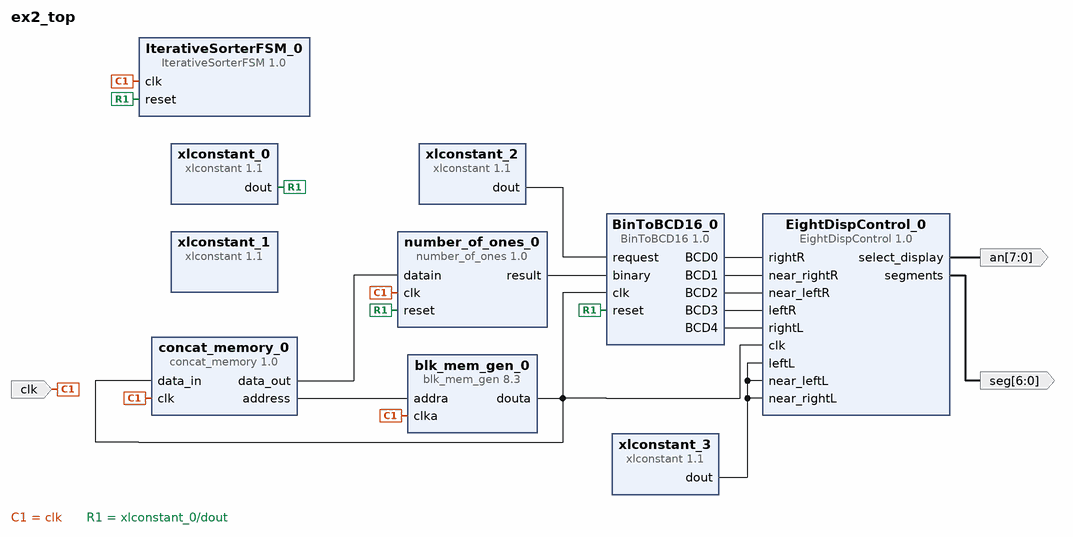
[diagram p0: block diagram of the top level]
# Vivado block design ex2_top, xc7a100tcsg324-3, Vivado 2016.4
create_bd_design ex2_top

create_bd_port -dir I clk
create_bd_port -dir O -from 6 -to 0 seg
create_bd_port -dir O -from 7 -to 0 an

create_bd_cell -type ip -vlnv xilinx.com:ip:blk_mem_gen:8.3 blk_mem_gen_0
set_property -dict [list \
  CONFIG.Memory_Type Single_Port_ROM \
  CONFIG.Enable_32bit_Address false \
  CONFIG.Write_Width_A 16 \
  CONFIG.Enable_A Always_Enabled \
  CONFIG.Register_PortA_Output_of_Memory_Primitives true \
  CONFIG.Load_Init_File true \
  CONFIG.Coe_File ../../../../../../../ex1/vector128_16bits_random.coe \
  CONFIG.Use_RSTA_Pin false \
  CONFIG.Port_A_Write_Rate 0 \
  CONFIG.use_bram_block Stand_Alone \
] [get_bd_cells blk_mem_gen_0]
create_bd_cell -type ip -vlnv xilinx.com:ip:xlconstant:1.1 xlconstant_0
set_property -dict {CONFIG.CONST_VAL 0} [get_bd_cells xlconstant_0]
create_bd_cell -type ip -vlnv xilinx.com:ip:xlconstant:1.1 xlconstant_1
set_property -dict [list \
  CONFIG.CONST_WIDTH 2048 \
  CONFIG.CONST_VAL 246491845720448363234320918139641183926606108956339119321204156302227128493193731643123130206991700930548251832903632539127731125325932694089962488321942283325779103049983230322952719123214452217330368582308859838105801571824052182411677524049702180817525916145772952417227156212561424886491415871177592576111276257646483273730326312474588293293771651419882528183461519325693159622888019654596878291642675438012696894811984224282470228412314902102930242242262327432603167153081331554745823756124441861154449492384327291340433011806154497929754332024746313232242541581049310774614322522116920676 \
] [get_bd_cells xlconstant_1]
create_bd_cell -type ip -vlnv xilinx.com:user:concat_memory:1.0 concat_memory_0
create_bd_cell -type ip -vlnv xilinx.com:ip:xlconstant:1.1 xlconstant_2
create_bd_cell -type ip -vlnv ua.pt:user:EightDispControl:1.0 EightDispControl_0
create_bd_cell -type ip -vlnv xilinx.com:ip:xlconstant:1.1 xlconstant_3
set_property -dict {CONFIG.CONST_WIDTH 4 CONFIG.CONST_VAL 0} [get_bd_cells xlconstant_3]
create_bd_cell -type ip -vlnv xilinx.com:user:number_of_ones:1.0 number_of_ones_0
set_property -dict {CONFIG.number_of_bits_input 2048 CONFIG.number_of_bits_output 16} [get_bd_cells number_of_ones_0]
create_bd_cell -type ip -vlnv xilinx.com:user:IterativeSorterFSM:1.0 IterativeSorterFSM_0
set_property -dict {CONFIG.L 16 CONFIG.M 128} [get_bd_cells IterativeSorterFSM_0]
create_bd_cell -type ip -vlnv ua.pt:user:BinToBCD16:1.0 BinToBCD16_0

# ---- connections ----

connect_bd_net [get_bd_ports clk] \
  [get_bd_pins blk_mem_gen_0/clka] [get_bd_pins concat_memory_0/clk] [get_bd_pins number_of_ones_0/clk] \
  [get_bd_pins IterativeSorterFSM_0/clk]
connect_bd_net [get_bd_pins xlconstant_0/dout] \
  [get_bd_pins number_of_ones_0/reset] [get_bd_pins IterativeSorterFSM_0/reset] [get_bd_pins BinToBCD16_0/reset]
connect_bd_net [get_bd_pins blk_mem_gen_0/douta] \
  [get_bd_pins concat_memory_0/data_in] [get_bd_pins EightDispControl_0/clk] [get_bd_pins BinToBCD16_0/clk]
connect_bd_net [get_bd_pins concat_memory_0/address] [get_bd_pins blk_mem_gen_0/addra]
connect_bd_net [get_bd_pins xlconstant_2/dout] [get_bd_pins BinToBCD16_0/request]
connect_bd_net [get_bd_pins BinToBCD16_0/BCD0] [get_bd_pins EightDispControl_0/rightR]
connect_bd_net [get_bd_pins BinToBCD16_0/BCD1] [get_bd_pins EightDispControl_0/near_rightR]
connect_bd_net [get_bd_pins BinToBCD16_0/BCD2] [get_bd_pins EightDispControl_0/near_leftR]
connect_bd_net [get_bd_pins BinToBCD16_0/BCD3] [get_bd_pins EightDispControl_0/leftR]
connect_bd_net [get_bd_pins BinToBCD16_0/BCD4] [get_bd_pins EightDispControl_0/rightL]
connect_bd_net [get_bd_pins EightDispControl_0/segments] [get_bd_ports seg]
connect_bd_net [get_bd_pins EightDispControl_0/select_display] [get_bd_ports an]
connect_bd_net [get_bd_pins xlconstant_3/dout] \
  [get_bd_pins EightDispControl_0/leftL] [get_bd_pins EightDispControl_0/near_leftL] \
  [get_bd_pins EightDispControl_0/near_rightL]
connect_bd_net [get_bd_pins number_of_ones_0/result] [get_bd_pins BinToBCD16_0/binary]
connect_bd_net [get_bd_pins concat_memory_0/data_out] [get_bd_pins number_of_ones_0/datain]

validate_bd_design
save_bd_design
